# Altium schematic sheet HashUnit3.SchDoc: ANT_Miner_V1.3
size A2; Date: 2013/11/20; DrawnBy: Bitmain Technology; SheetNumber: 8; SheetTotal: 9
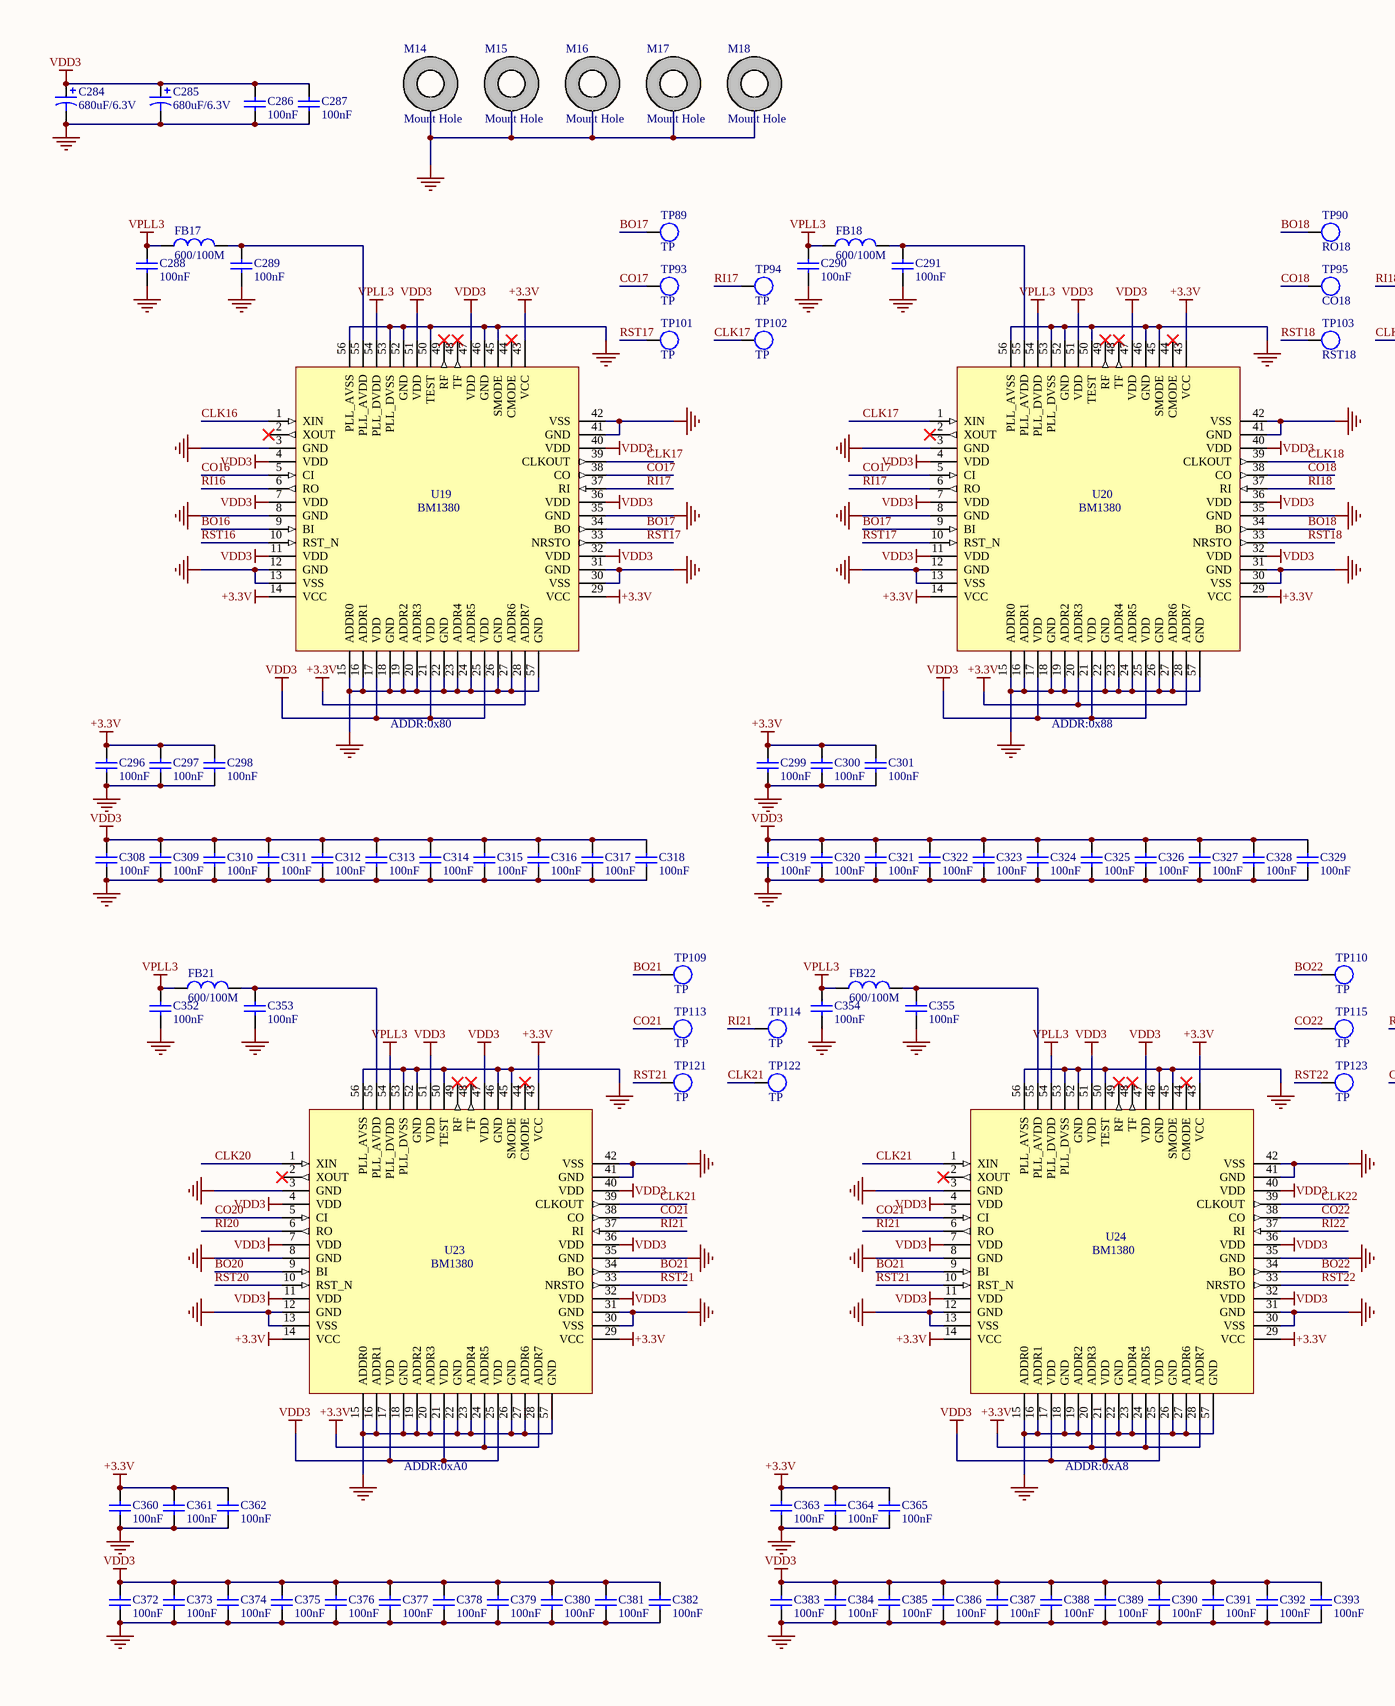
[diagram p0: HashUnit3.SchDoc, left]
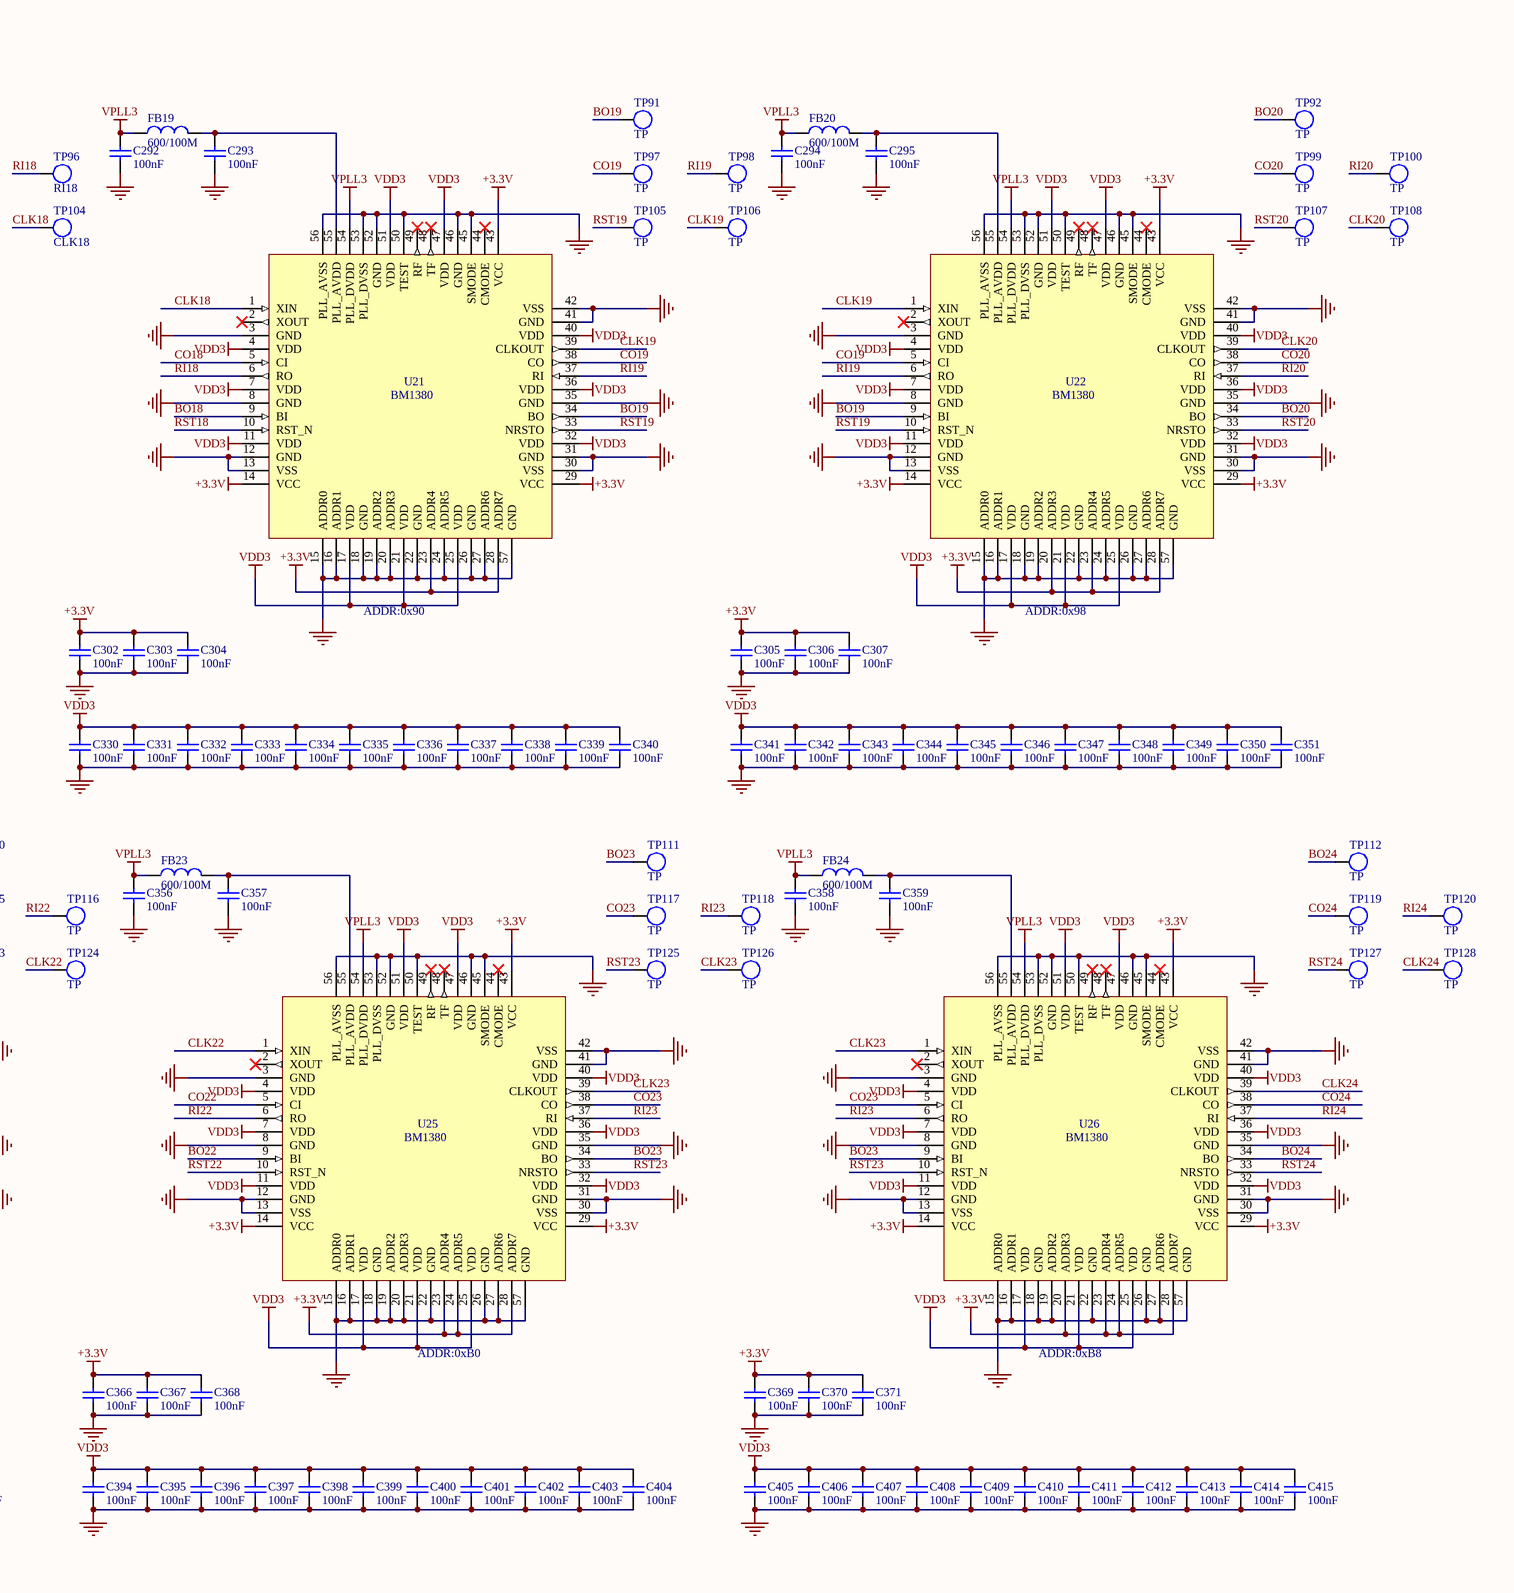
[diagram p1: HashUnit3.SchDoc, right]

## Parts
C284  680uF/6.3V  [D]
C285  680uF/6.3V  [D]
C286  100nF  [CC0603(1608)]
C287  100nF  [CC0603(1608)]
C288  100nF  [CC0603(1608)]
C289  100nF  [CC0603(1608)]
C290  100nF  [CC0603(1608)]
C291  100nF  [CC0603(1608)]
C292  100nF  [CC0603(1608)]
C293  100nF  [CC0603(1608)]
C294  100nF  [CC0603(1608)]
C295  100nF  [CC0603(1608)]
C296  100nF  [CC0603(1608)]
C297  100nF  [CC0603(1608)]
C298  100nF  [CC0603(1608)]
C299  100nF  [CC0603(1608)]
C300  100nF  [CC0603(1608)]
C301  100nF  [CC0603(1608)]
C302  100nF  [CC0603(1608)]
C303  100nF  [CC0603(1608)]
C304  100nF  [CC0603(1608)]
C305  100nF  [CC0603(1608)]
C306  100nF  [CC0603(1608)]
C307  100nF  [CC0603(1608)]
C308  100nF  [CC0603(1608)]
C309  100nF  [CC0603(1608)]
C310  100nF  [CC0603(1608)]
C311  100nF  [CC0603(1608)]
C312  100nF  [CC0603(1608)]
C313  100nF  [CC0603(1608)]
C314  100nF  [CC0603(1608)]
C315  100nF  [CC0603(1608)]
C316  100nF  [CC0603(1608)]
C317  100nF  [CC0603(1608)]
C318  100nF  [CC0603(1608)]
C319  100nF  [CC0603(1608)]
C320  100nF  [CC0603(1608)]
C321  100nF  [CC0603(1608)]
C322  100nF  [CC0603(1608)]
C323  100nF  [CC0603(1608)]
C324  100nF  [CC0603(1608)]
C325  100nF  [CC0603(1608)]
C326  100nF  [CC0603(1608)]
C327  100nF  [CC0603(1608)]
C328  100nF  [CC0603(1608)]
C329  100nF  [CC0603(1608)]
C330  100nF  [CC0603(1608)]
C331  100nF  [CC0603(1608)]
C332  100nF  [CC0603(1608)]
C333  100nF  [CC0603(1608)]
C334  100nF  [CC0603(1608)]
C335  100nF  [CC0603(1608)]
C336  100nF  [CC0603(1608)]
C337  100nF  [CC0603(1608)]
C338  100nF  [CC0603(1608)]
C339  100nF  [CC0603(1608)]
C340  100nF  [CC0603(1608)]
C341  100nF  [CC0603(1608)]
C342  100nF  [CC0603(1608)]
C343  100nF  [CC0603(1608)]
C344  100nF  [CC0603(1608)]
C345  100nF  [CC0603(1608)]
C346  100nF  [CC0603(1608)]
C347  100nF  [CC0603(1608)]
C348  100nF  [CC0603(1608)]
C349  100nF  [CC0603(1608)]
C350  100nF  [CC0603(1608)]
C351  100nF  [CC0603(1608)]
C352  100nF  [CC0603(1608)]
C353  100nF  [CC0603(1608)]
C354  100nF  [CC0603(1608)]
C355  100nF  [CC0603(1608)]
C356  100nF  [CC0603(1608)]
C357  100nF  [CC0603(1608)]
C358  100nF  [CC0603(1608)]
C359  100nF  [CC0603(1608)]
C360  100nF  [CC0603(1608)]
C361  100nF  [CC0603(1608)]
C362  100nF  [CC0603(1608)]
C363  100nF  [CC0603(1608)]
C364  100nF  [CC0603(1608)]
C365  100nF  [CC0603(1608)]
C366  100nF  [CC0603(1608)]
C367  100nF  [CC0603(1608)]
C368  100nF  [CC0603(1608)]
C369  100nF  [CC0603(1608)]
C370  100nF  [CC0603(1608)]
C371  100nF  [CC0603(1608)]
C372  100nF  [CC0603(1608)]
C373  100nF  [CC0603(1608)]
C374  100nF  [CC0603(1608)]
C375  100nF  [CC0603(1608)]
C376  100nF  [CC0603(1608)]
C377  100nF  [CC0603(1608)]
C378  100nF  [CC0603(1608)]
C379  100nF  [CC0603(1608)]
C380  100nF  [CC0603(1608)]
C381  100nF  [CC0603(1608)]
C382  100nF  [CC0603(1608)]
C383  100nF  [CC0603(1608)]
C384  100nF  [CC0603(1608)]
C385  100nF  [CC0603(1608)]
C386  100nF  [CC0603(1608)]
C387  100nF  [CC0603(1608)]
C388  100nF  [CC0603(1608)]
C389  100nF  [CC0603(1608)]
C390  100nF  [CC0603(1608)]
C391  100nF  [CC0603(1608)]
C392  100nF  [CC0603(1608)]
C393  100nF  [CC0603(1608)]
C394  100nF  [CC0603(1608)]
C395  100nF  [CC0603(1608)]
C396  100nF  [CC0603(1608)]
C397  100nF  [CC0603(1608)]
C398  100nF  [CC0603(1608)]
C399  100nF  [CC0603(1608)]
C400  100nF  [CC0603(1608)]
C401  100nF  [CC0603(1608)]
C402  100nF  [CC0603(1608)]
C403  100nF  [CC0603(1608)]
C404  100nF  [CC0603(1608)]
C405  100nF  [CC0603(1608)]
C406  100nF  [CC0603(1608)]
C407  100nF  [CC0603(1608)]
C408  100nF  [CC0603(1608)]
C409  100nF  [CC0603(1608)]
C410  100nF  [CC0603(1608)]
C411  100nF  [CC0603(1608)]
C412  100nF  [CC0603(1608)]
C413  100nF  [CC0603(1608)]
C414  100nF  [CC0603(1608)]
C415  100nF  [CC0603(1608)]
FB17  600/100M  [FB0603(1608)]
FB18  600/100M  [FB0603(1608)]
FB19  600/100M  [FB0603(1608)]
FB20  600/100M  [FB0603(1608)]
FB21  600/100M  [FB0603(1608)]
FB22  600/100M  [FB0603(1608)]
FB23  600/100M  [FB0603(1608)]
FB24  600/100M  [FB0603(1608)]
M14  Mount Hole  [MHOLE2]
M15  Mount Hole  [MHOLE2]
M16  Mount Hole  [MHOLE2]
M17  Mount Hole  [MHOLE2]
M18  Mount Hole  [MHOLE2]
TP89  TP  [TP_SMD]
TP90  value RO18  [TP_SMD]  (hidden comment: TP)
TP91  TP  [TP_SMD]
TP92  TP  [TP_SMD]
TP93  TP  [TP_SMD]
TP94  TP  [TP_SMD]
TP95  value CO18  [TP_SMD]  (hidden comment: TP)
TP96  value RI18  [TP_SMD]  (hidden comment: TP)
TP97  TP  [TP_SMD]
TP98  TP  [TP_SMD]
TP99  TP  [TP_SMD]
TP100  TP  [TP_SMD]
TP101  TP  [TP_SMD]
TP102  TP  [TP_SMD]
TP103  value RST18  [TP_SMD]  (hidden comment: TP)
TP104  value CLK18  [TP_SMD]  (hidden comment: TP)
TP105  TP  [TP_SMD]
TP106  TP  [TP_SMD]
TP107  TP  [TP_SMD]
TP108  TP  [TP_SMD]
TP109  TP  [TP_SMD]
TP110  TP  [TP_SMD]
TP111  TP  [TP_SMD]
TP112  TP  [TP_SMD]
TP113  TP  [TP_SMD]
TP114  TP  [TP_SMD]
TP115  TP  [TP_SMD]
TP116  TP  [TP_SMD]
TP117  TP  [TP_SMD]
TP118  TP  [TP_SMD]
TP119  TP  [TP_SMD]
TP120  TP  [TP_SMD]
TP121  TP  [TP_SMD]
TP122  TP  [TP_SMD]
TP123  TP  [TP_SMD]
TP124  TP  [TP_SMD]
TP125  TP  [TP_SMD]
TP126  TP  [TP_SMD]
TP127  TP  [TP_SMD]
TP128  TP  [TP_SMD]
U19  BM1380  [QFN56]
U20  BM1380  [QFN56]
U21  BM1380  [QFN56]
U22  BM1380  [QFN56]
U23  BM1380  [QFN56]
U24  BM1380  [QFN56]
U25  BM1380  [QFN56]
U26  BM1380  [QFN56]

## Nets
+3.3V: C296.2 C297.2 C298.2 C299.2 C300.2 C301.2 C302.2 C303.2 C304.2 C305.2 C306.2 C307.2 C360.2 C361.2 C362.2 C363.2 C364.2 C365.2 C366.2 C367.2 C368.2 C369.2 C370.2 C371.2 U19.14(VCC) U19.28(ADDR7) U19.29(VCC) U19.43(VCC) U20.14(VCC) U20.20(ADDR3) U20.28(ADDR7) U20.29(VCC) U20.43(VCC) U21.14(VCC) U21.23(ADDR4) U21.28(ADDR7) U21.29(VCC) U21.43(VCC) U22.14(VCC) U22.20(ADDR3) U22.23(ADDR4) U22.28(ADDR7) U22.29(VCC) U22.43(VCC) U23.14(VCC) U23.24(ADDR5) U23.28(ADDR7) U23.29(VCC) U23.43(VCC) U24.14(VCC) U24.20(ADDR3) U24.24(ADDR5) U24.28(ADDR7) U24.29(VCC) U24.43(VCC) U25.14(VCC) U25.23(ADDR4) U25.24(ADDR5) U25.28(ADDR7) U25.29(VCC) U25.43(VCC) U26.14(VCC) U26.20(ADDR3) U26.23(ADDR4) U26.24(ADDR5) U26.28(ADDR7) U26.29(VCC) U26.43(VCC)
GND: C284.2 C285.2 C286.1 C287.1 C288.2 C289.1 C290.2 C291.1 C292.2 C293.1 C294.2 C295.1 C296.1 C297.1 C298.1 C299.1 C300.1 C301.1 C302.1 C303.1 C304.1 C305.1 C306.1 C307.1 C308.1 C309.1 C310.1 C311.1 C312.1 C313.1 C314.1 C315.1 C316.1 C317.1 C318.1 C319.1 C320.1 C321.1 C322.1 C323.1 C324.1 C325.1 C326.1 C327.1 C328.1 C329.1 C330.1 C331.1 C332.1 C333.1 C334.1 C335.1 C336.1 C337.1 C338.1 C339.1 C340.1 C341.1 C342.1 C343.1 C344.1 C345.1 C346.1 C347.1 C348.1 C349.1 C350.1 C351.1 C352.2 C353.1 C354.2 C355.1 C356.2 C357.1 C358.2 C359.1 C360.1 C361.1 C362.1 C363.1 C364.1 C365.1 C366.1 C367.1 C368.1 C369.1 C370.1 C371.1 C372.1 C373.1 C374.1 C375.1 C376.1 C377.1 C378.1 C379.1 C380.1 C381.1 C382.1 C383.1 C384.1 C385.1 C386.1 C387.1 C388.1 C389.1 C390.1 C391.1 C392.1 C393.1 C394.1 C395.1 C396.1 C397.1 C398.1 C399.1 C400.1 C401.1 C402.1 C403.1 C404.1 C405.1 C406.1 C407.1 C408.1 C409.1 C410.1 C411.1 C412.1 C413.1 C414.1 C415.1 M14.0(PIN) M15.0(PIN) M16.0(PIN) M17.0(PIN) M18.0(PIN) U19.3(GND) U19.8(GND) U19.12(GND) U19.13(VSS) U19.15(ADDR0) U19.16(ADDR1) U19.18(GND) U19.19(ADDR2) U19.20(ADDR3) U19.22(GND) U19.23(ADDR4) U19.24(ADDR5) U19.26(GND) U19.27(ADDR6) U19.30(VSS) U19.31(GND) U19.35(GND) U19.41(GND) U19.42(VSS) U19.45(SMODE) U19.46(GND) U19.50(TEST) U19.52(GND) U19.53(PLL_DVSS) U19.56(PLL_AVSS) U19.57(GND) U20.3(GND) U20.8(GND) U20.12(GND) U20.13(VSS) U20.15(ADDR0) U20.16(ADDR1) U20.18(GND) U20.19(ADDR2) U20.22(GND) U20.23(ADDR4) U20.24(ADDR5) U20.26(GND) U20.27(ADDR6) U20.30(VSS) U20.31(GND) U20.35(GND) U20.41(GND) U20.42(VSS) U20.45(SMODE) U20.46(GND) U20.50(TEST) U20.52(GND) U20.53(PLL_DVSS) U20.56(PLL_AVSS) U20.57(GND) U21.3(GND) U21.8(GND) U21.12(GND) U21.13(VSS) U21.15(ADDR0) U21.16(ADDR1) U21.18(GND) U21.19(ADDR2) U21.20(ADDR3) U21.22(GND) U21.24(ADDR5) U21.26(GND) U21.27(ADDR6) U21.30(VSS) U21.31(GND) U21.35(GND) U21.41(GND) U21.42(VSS) U21.45(SMODE) U21.46(GND) U21.50(TEST) U21.52(GND) U21.53(PLL_DVSS) U21.56(PLL_AVSS) U21.57(GND) U22.3(GND) U22.8(GND) U22.12(GND) U22.13(VSS) U22.15(ADDR0) U22.16(ADDR1) U22.18(GND) U22.19(ADDR2) U22.22(GND) U22.24(ADDR5) U22.26(GND) U22.27(ADDR6) U22.30(VSS) U22.31(GND) U22.35(GND) U22.41(GND) U22.42(VSS) U22.45(SMODE) U22.46(GND) U22.50(TEST) U22.52(GND) U22.53(PLL_DVSS) U22.56(PLL_AVSS) U22.57(GND) U23.3(GND) U23.8(GND) U23.12(GND) U23.13(VSS) U23.15(ADDR0) U23.16(ADDR1) U23.18(GND) U23.19(ADDR2) U23.20(ADDR3) U23.22(GND) U23.23(ADDR4) U23.26(GND) U23.27(ADDR6) U23.30(VSS) U23.31(GND) U23.35(GND) U23.41(GND) U23.42(VSS) U23.45(SMODE) U23.46(GND) U23.50(TEST) U23.52(GND) U23.53(PLL_DVSS) U23.56(PLL_AVSS) U23.57(GND) U24.3(GND) U24.8(GND) U24.12(GND) U24.13(VSS) U24.15(ADDR0) U24.16(ADDR1) U24.18(GND) U24.19(ADDR2) U24.22(GND) U24.23(ADDR4) U24.26(GND) U24.27(ADDR6) U24.30(VSS) U24.31(GND) U24.35(GND) U24.41(GND) U24.42(VSS) U24.45(SMODE) U24.46(GND) U24.50(TEST) U24.52(GND) U24.53(PLL_DVSS) U24.56(PLL_AVSS) U24.57(GND) U25.3(GND) U25.8(GND) U25.12(GND) U25.13(VSS) U25.15(ADDR0) U25.16(ADDR1) U25.18(GND) U25.19(ADDR2) U25.20(ADDR3) U25.22(GND) U25.26(GND) U25.27(ADDR6) U25.30(VSS) U25.31(GND) U25.35(GND) U25.41(GND) U25.42(VSS) U25.45(SMODE) U25.46(GND) U25.50(TEST) U25.52(GND) U25.53(PLL_DVSS) U25.56(PLL_AVSS) U25.57(GND) U26.3(GND) U26.8(GND) U26.12(GND) U26.13(VSS) U26.15(ADDR0) U26.16(ADDR1) U26.18(GND) U26.19(ADDR2) U26.22(GND) U26.26(GND) U26.27(ADDR6) U26.30(VSS) U26.31(GND) U26.35(GND) U26.41(GND) U26.42(VSS) U26.45(SMODE) U26.46(GND) U26.50(TEST) U26.52(GND) U26.53(PLL_DVSS) U26.56(PLL_AVSS) U26.57(GND)
VDD3: C284.1 C285.1 C286.2 C287.2 C308.2 C309.2 C310.2 C311.2 C312.2 C313.2 C314.2 C315.2 C316.2 C317.2 C318.2 C319.2 C320.2 C321.2 C322.2 C323.2 C324.2 C325.2 C326.2 C327.2 C328.2 C329.2 C330.2 C331.2 C332.2 C333.2 C334.2 C335.2 C336.2 C337.2 C338.2 C339.2 C340.2 C341.2 C342.2 C343.2 C344.2 C345.2 C346.2 C347.2 C348.2 C349.2 C350.2 C351.2 C372.2 C373.2 C374.2 C375.2 C376.2 C377.2 C378.2 C379.2 C380.2 C381.2 C382.2 C383.2 C384.2 C385.2 C386.2 C387.2 C388.2 C389.2 C390.2 C391.2 C392.2 C393.2 C394.2 C395.2 C396.2 C397.2 C398.2 C399.2 C400.2 C401.2 C402.2 C403.2 C404.2 C405.2 C406.2 C407.2 C408.2 C409.2 C410.2 C411.2 C412.2 C413.2 C414.2 C415.2 U19.4(VDD) U19.7(VDD) U19.11(VDD) U19.17(VDD) U19.21(VDD) U19.25(VDD) U19.32(VDD) U19.36(VDD) U19.40(VDD) U19.47(VDD) U19.51(VDD) U20.4(VDD) U20.7(VDD) U20.11(VDD) U20.17(VDD) U20.21(VDD) U20.25(VDD) U20.32(VDD) U20.36(VDD) U20.40(VDD) U20.47(VDD) U20.51(VDD) U21.4(VDD) U21.7(VDD) U21.11(VDD) U21.17(VDD) U21.21(VDD) U21.25(VDD) U21.32(VDD) U21.36(VDD) U21.40(VDD) U21.47(VDD) U21.51(VDD) U22.4(VDD) U22.7(VDD) U22.11(VDD) U22.17(VDD) U22.21(VDD) U22.25(VDD) U22.32(VDD) U22.36(VDD) U22.40(VDD) U22.47(VDD) U22.51(VDD) U23.4(VDD) U23.7(VDD) U23.11(VDD) U23.17(VDD) U23.21(VDD) U23.25(VDD) U23.32(VDD) U23.36(VDD) U23.40(VDD) U23.47(VDD) U23.51(VDD) U24.4(VDD) U24.7(VDD) U24.11(VDD) U24.17(VDD) U24.21(VDD) U24.25(VDD) U24.32(VDD) U24.36(VDD) U24.40(VDD) U24.47(VDD) U24.51(VDD) U25.4(VDD) U25.7(VDD) U25.11(VDD) U25.17(VDD) U25.21(VDD) U25.25(VDD) U25.32(VDD) U25.36(VDD) U25.40(VDD) U25.47(VDD) U25.51(VDD) U26.4(VDD) U26.7(VDD) U26.11(VDD) U26.17(VDD) U26.21(VDD) U26.25(VDD) U26.32(VDD) U26.36(VDD) U26.40(VDD) U26.47(VDD) U26.51(VDD)
VPLL3: C288.1 C290.1 C292.1 C294.1 C352.1 C354.1 C356.1 C358.1 FB17.2 FB18.2 FB19.2 FB20.2 FB21.2 FB22.2 FB23.2 FB24.2 U19.54(PLL_DVDD) U20.54(PLL_DVDD) U21.54(PLL_DVDD) U22.54(PLL_DVDD) U23.54(PLL_DVDD) U24.54(PLL_DVDD) U25.54(PLL_DVDD) U26.54(PLL_DVDD)
BO16: U19.9(BI)
BO17: TP89.1 U19.34(BO) U20.9(BI)
BO18: TP90.1 U20.34(BO) U21.9(BI)
BO19: TP91.1 U21.34(BO) U22.9(BI)
BO20: TP92.1 U22.34(BO) U23.9(BI)
BO21: TP109.1 U23.34(BO) U24.9(BI)
BO22: TP110.1 U24.34(BO) U25.9(BI)
BO23: TP111.1 U25.34(BO) U26.9(BI)
BO24: TP112.1 U26.34(BO)
CLK16: U19.1(XIN)
CLK17: TP102.1 U19.39(CLKOUT) U20.1(XIN)
CLK18: TP104.1 U20.39(CLKOUT) U21.1(XIN)
CLK19: TP106.1 U21.39(CLKOUT) U22.1(XIN)
CLK20: TP108.1 U22.39(CLKOUT) U23.1(XIN)
CLK21: TP122.1 U23.39(CLKOUT) U24.1(XIN)
CLK22: TP124.1 U24.39(CLKOUT) U25.1(XIN)
CLK23: TP126.1 U25.39(CLKOUT) U26.1(XIN)
CLK24: TP128.1 U26.39(CLKOUT)
CO16: U19.5(CI)
CO17: TP93.1 U19.38(CO) U20.5(CI)
CO18: TP95.1 U20.38(CO) U21.5(CI)
CO19: TP97.1 U21.38(CO) U22.5(CI)
CO20: TP99.1 U22.38(CO) U23.5(CI)
CO21: TP113.1 U23.38(CO) U24.5(CI)
CO22: TP115.1 U24.38(CO) U25.5(CI)
CO23: TP117.1 U25.38(CO) U26.5(CI)
CO24: TP119.1 U26.38(CO)
RI16: U19.6(RO)
RI17: TP94.1 U19.37(RI) U20.6(RO)
RI18: TP96.1 U20.37(RI) U21.6(RO)
RI19: TP98.1 U21.37(RI) U22.6(RO)
RI20: TP100.1 U22.37(RI) U23.6(RO)
RI21: TP114.1 U23.37(RI) U24.6(RO)
RI22: TP116.1 U24.37(RI) U25.6(RO)
RI23: TP118.1 U25.37(RI) U26.6(RO)
RI24: TP120.1 U26.37(RI)
RST16: U19.10(RST_N)
RST17: TP101.1 U19.33(NRSTO) U20.10(RST_N)
RST18: TP103.1 U20.33(NRSTO) U21.10(RST_N)
RST19: TP105.1 U21.33(NRSTO) U22.10(RST_N)
RST20: TP107.1 U22.33(NRSTO) U23.10(RST_N)
RST21: TP121.1 U23.33(NRSTO) U24.10(RST_N)
RST22: TP123.1 U24.33(NRSTO) U25.10(RST_N)
RST23: TP125.1 U25.33(NRSTO) U26.10(RST_N)
RST24: TP127.1 U26.33(NRSTO)
NetC289_2: C289.2 FB17.1 U19.55(PLL_AVDD)
NetC291_2: C291.2 FB18.1 U20.55(PLL_AVDD)
NetC293_2: C293.2 FB19.1 U21.55(PLL_AVDD)
NetC295_2: C295.2 FB20.1 U22.55(PLL_AVDD)
NetC353_2: C353.2 FB21.1 U23.55(PLL_AVDD)
NetC355_2: C355.2 FB22.1 U24.55(PLL_AVDD)
NetC357_2: C357.2 FB23.1 U25.55(PLL_AVDD)
NetC359_2: C359.2 FB24.1 U26.55(PLL_AVDD)

Not connected (* = marked no-connect by the designer): U19 2(XOUT)* 44(CMODE)* 48(TF)* 49(RF)*; U20 2(XOUT)* 44(CMODE)* 48(TF)* 49(RF)*; U21 2(XOUT)* 44(CMODE)* 48(TF)* 49(RF)*; U22 2(XOUT)* 44(CMODE)* 48(TF)* 49(RF)*; U23 2(XOUT)* 44(CMODE)* 48(TF)* 49(RF)*; U24 2(XOUT)* 44(CMODE)* 48(TF)* 49(RF)*; U25 2(XOUT)* 44(CMODE)* 48(TF)* 49(RF)*; U26 2(XOUT)* 44(CMODE)* 48(TF)* 49(RF)*

## Notes on the sheet
- ADDR:0x80
- ADDR:0x88
- ADDR:0x90
- ADDR:0x98
- ADDR:0xA0
- ADDR:0xA8
- ADDR:0xB0
- ADDR:0xB8

## Library data of the parts
C284 C285 = T492C: Solid Tantalum Chip Capacitor, T492 Series - CWR11 Style Per Mil-PRF-55365/8; Published: 17-Jul-2002; LatestRevisionDate: 19-Mar-2004; LatestRevisionNote: Silkscreen dimensions re-sized.; DatasheetDocument: Mar-2001; PackageDocument: Mar-2001; PackageReference: C; Publisher: Altium Limited; Code_JEITA: 6032-28; ComponentLink1Description: Manufacturer Link; ComponentLink1URL: http://www.kemet.com/; ComponentLink2Description: Datasheet; ComponentLink2URL: http://www.kemet.com/kemet/web/homepage/kechome.nsf/vapubfilesname/F3102TA.pdf/$file/F3102TA.pdf; Value: 680uF/6.3V
C286 C287 = Cap Semi: Capacitor (Semiconductor SIM Model); Published: 8-Jun-2000; LatestRevisionDate: 29-May-2009; LatestRevisionNote: IPC-7351 Footprint Added.; PackageReference: C1206; Publisher: Altium Limited; PackageDescription: Chip Capacitor; Value: 100nF
C288-C415 = Cap: Capacitor; Published: 8-Jun-2000; LatestRevisionDate: 17-Jul-2002; LatestRevisionNote: Re-released for DXP Platform.; PackageReference: RAD-0.3; Publisher: Altium Limited; PackageDescription: Radial Cap, Thru-Hole; 2 Leads; 0.3 in Pin Spacing; Value: 100nF
FB17-FB24 = FB: Inductor; Code_IEC: 1005; Published: 8-Jun-2000; LatestRevisionDate: 29-May-2009; LatestRevisionNote: IPC-7351 Footprint Added.; PackageReference: 0402-A; Publisher: Altium Limited; PackageDescription: Chip Inductor; Code_JEITA: 0402; Value: 600/100M
M14-M18 = M_Hole
TP89-TP128 = TP: Test Point
  TP89 TP91-TP94 TP97-TP102 TP105-TP128: Value: TP